# EAGLE design Current_Picker (EAGLE 5.11)
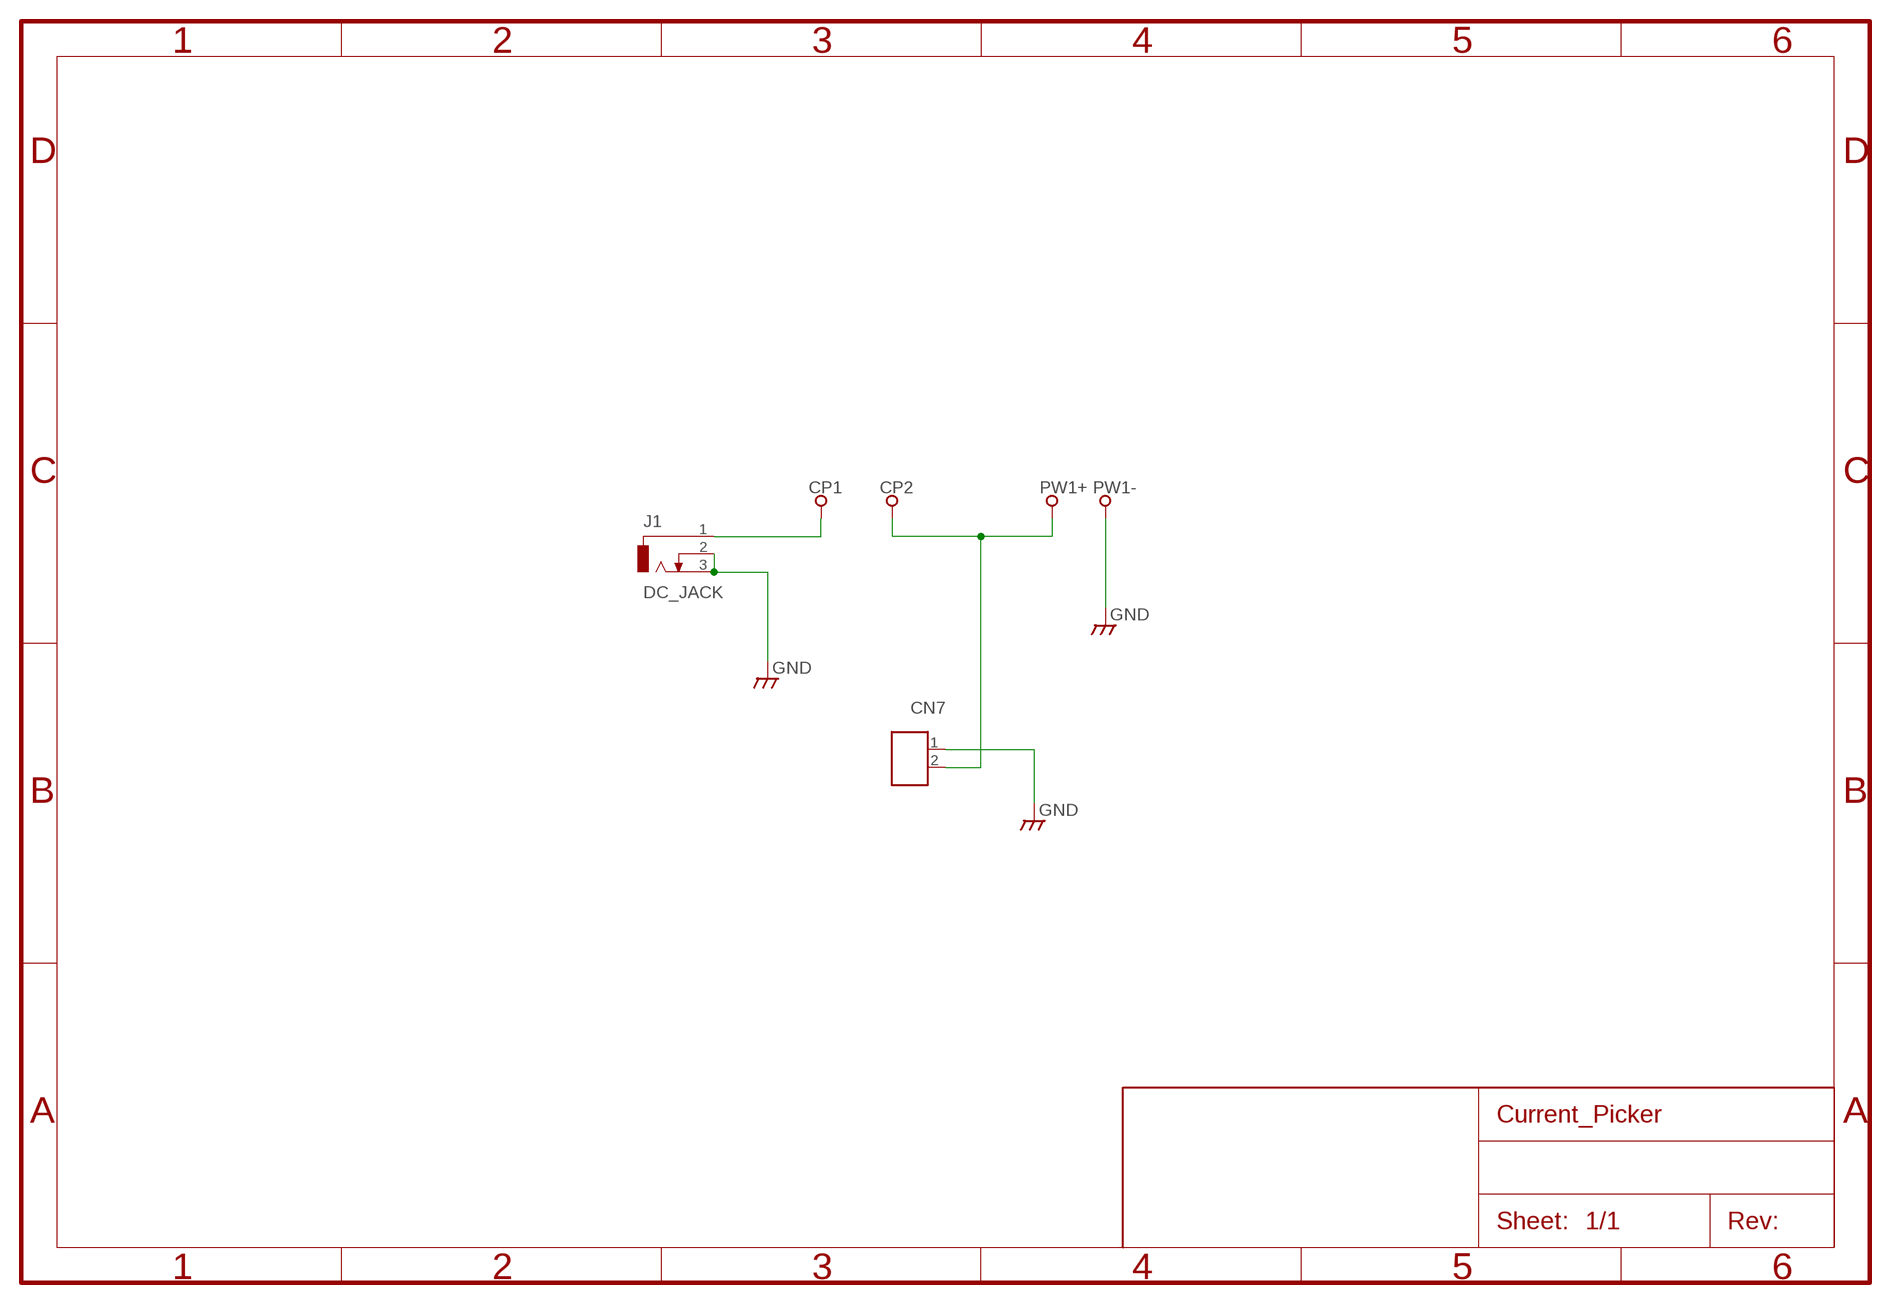
[diagram p0: schematic, sheet 1]

## Parts
CN7  CON_2P  [CON_HRS_DIP_2]
CP1  TP1R  [TP1]
CP2  TP1R  [TP1]
J1  DC_JACK  [DCJ0202]
PW1+  TP1R  [TP1]
PW1-  TP1R  [TP1]

## Nets
GND: CN7.1 J1.2 J1.3 PW1-.P$1
N$2: CP1.P$1 J1.1
N$3: CN7.2 CP2.P$1 PW1+.P$1

## Library data of the parts
CN7 = MyLib:CON_2P: 2P Molex Connector
CP1 CP2 PW1+ PW1- = MyLib:TP1: 1 Pin Test Point
J1 = MyLib:DC_JACK: DC Jack with Switch

## Board
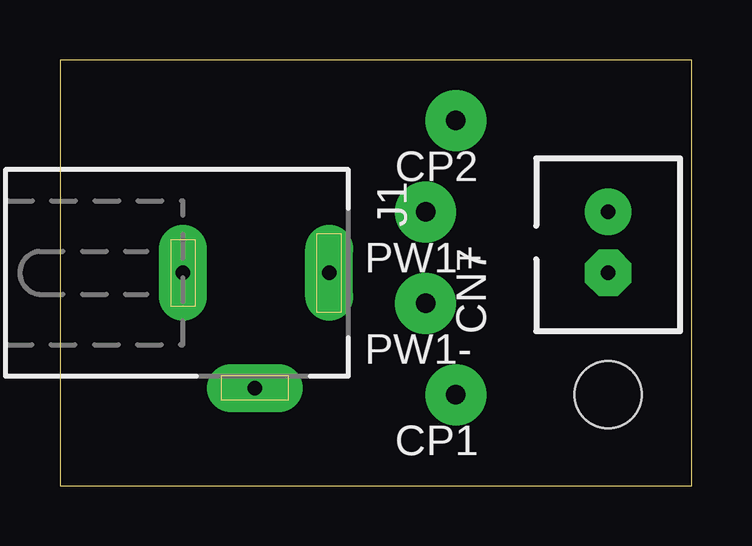
[diagram p1: board, top side]
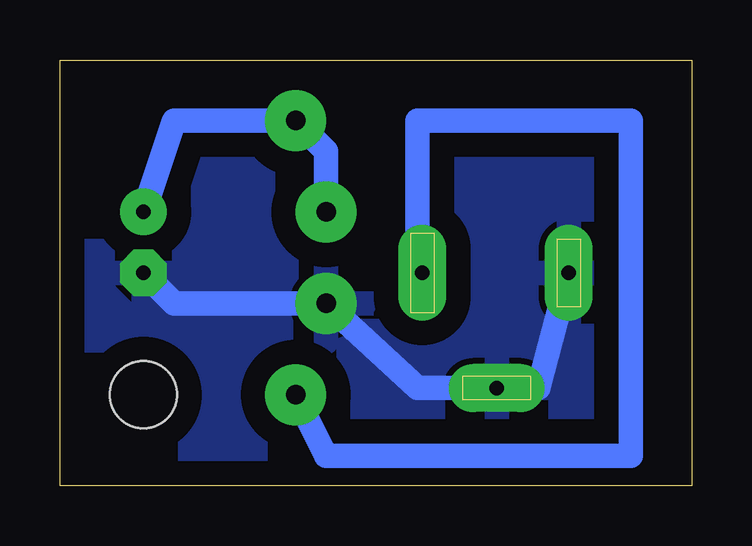
[diagram p2: board, bottom side, seen from below]

Size 26.34 x 17.77 mm. Coordinates in mm from the lower left corner, seen from the top.
Outline: 0,0 26.34,0 26.34,17.77 0,17.77 0,0
Copper layers (1*16): Top 0.035mm / dielectric 1.5mm / Bottom 0.035mm
Design rules "default": minimum track width 10mil, minimum drill 24mil, track to track 8mil, track to pad 8mil, pad to pad 8mil, via to via 8mil, smd to smd 8mil, copper to edge 40mil, drill to drill 8mil, minimum pad ring 10mil, minimum via ring 8mil, stop-mask expansion 4mil, vias tented up to drill 0mil, thermal gap 10mil
Holes 2.8 mm at 22.86,3.81

### Footprints (pad centres in the part's own frame; a part is rotated, then mirrored left to right if it is on the bottom)
CON_HRS_DIP_2 = drill 0.6 pad 1.93 octagon: 1 -1.27,0 | drill 0.6 pad 1.93 round: 2 1.27,0
TP1 = drill 0.813 pad 2.54 round: P$1 0,0
DCJ0202 = drill 0.6 pad 2 long: 1 0,6.148; 2 4.8,3.048; 3 0,0.048

### Placement (x,y rotation side)
CN7  22.86,10.16 90 top
CP1  16.51,3.81 0 top
CP2  16.51,15.24 0 top
J1  5.08,8.89 270 top
PW1+  15.24,11.43 0 top
PW1-  15.24,7.62 0 top

### Tracks (layer width: path | path; a pad name or v marks a point on that pad's centre or on a via)
GND
  Bottom 0.254: J1.3 5.08,8.89
  Bottom 1.016: CN7.1 21.59,7.62 PW1-.P$1 11.43,4.09 J1.2 6.4,4.09 J1.3
  pour Bottom (isolate 1.016): 0,17.78 0,0 26.67,0 26.67,1.27 26.67,17.78
N$2
  Bottom 0.254: 11.43,8.89 J1.1
  Bottom 1.016: 11.43,8.89 11.43,15.24 2.54,15.24 2.54,1.27 15.24,1.27 CP1.P$1
N$3
  Bottom 1.016: CN7.2 21.59,15.24 CP2.P$1 15.24,13.97 PW1+.P$1